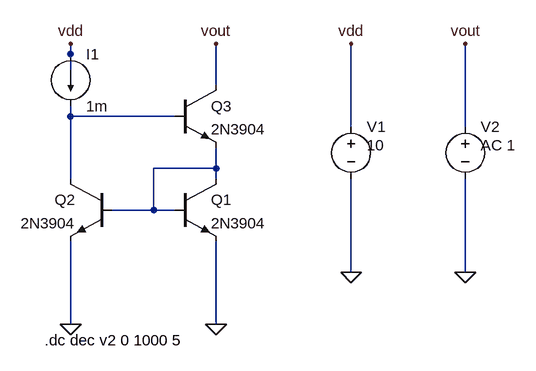
[diagram p0: schematic meros 1o (d).asc]
meros 1o (d).asc, the LTspice schematic file:
Version 4
SHEET 1 880 680
WIRE 96 48 96 32
WIRE 96 96 96 48
WIRE 320 96 320 32
WIRE 96 144 96 128
WIRE 256 144 96 144
WIRE 528 160 528 32
WIRE 704 160 704 32
WIRE 320 224 320 192
WIRE 320 224 224 224
WIRE 96 240 96 144
WIRE 320 240 320 224
WIRE 224 288 224 224
WIRE 224 288 160 288
WIRE 256 288 224 288
WIRE 528 384 528 240
WIRE 704 384 704 240
WIRE 96 464 96 336
WIRE 320 464 320 336
FLAG 320 464 0
FLAG 96 464 0
FLAG 96 32 vdd
FLAG 528 32 vdd
FLAG 320 32 vout
FLAG 704 32 vout
FLAG 528 384 0
FLAG 704 384 0
SYMBOL npn 256 96 R0
SYMATTR InstName Q3
SYMATTR Value 2N3904
SYMBOL npn 256 240 R0
SYMATTR InstName Q1
SYMATTR Value 2N3904
SYMBOL npn 160 240 M0
SYMATTR InstName Q2
SYMATTR Value 2N3904
SYMBOL current 96 48 R0
WINDOW 123 0 0 Left 0
WINDOW 39 0 0 Left 0
SYMATTR InstName I1
SYMATTR Value 1m
SYMBOL voltage 528 144 R0
WINDOW 123 0 0 Left 0
WINDOW 39 0 0 Left 0
WINDOW 3 24 44 Left 2
SYMATTR Value 10
SYMATTR InstName V1
SYMBOL voltage 704 144 R0
WINDOW 123 24 44 Left 2
WINDOW 39 0 0 Left 0
SYMATTR Value2 AC 1
SYMATTR InstName V2
SYMATTR Value ""
TEXT 56 488 Left 2 !.dc dec v2 0 1000 5

The netlist it stands for:
* meros 1o (d).asc
Q3 vout N001 N002 0 2N3904
Q1 N002 N002 0 0 2N3904
Q2 N001 N002 0 0 2N3904
I1 vdd N001 1m
V1 vdd 0 10
V2 vout 0 AC 1
.model NPN NPN
.model PNP PNP
.lib standard.bjt
.dc dec v2 0 1000 5
.backanno
.end